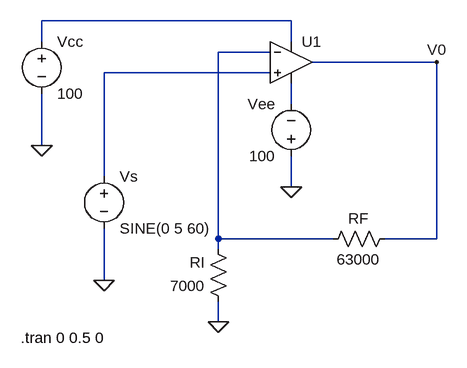
[diagram p0: schematic assig1_q2.asc]
assig1_q2.asc, the LTspice schematic file:
Version 4
SHEET 1 880 680
WIRE 416 112 32 112
WIRE 32 144 32 112
WIRE 416 144 416 112
WIRE 384 160 304 160
WIRE 640 176 448 176
WIRE 384 192 128 192
WIRE 416 240 416 208
WIRE 32 304 32 224
WIRE 128 352 128 192
WIRE 416 368 416 320
WIRE 304 448 304 160
WIRE 480 448 304 448
WIRE 640 448 640 176
WIRE 640 448 560 448
WIRE 304 464 304 448
WIRE 128 512 128 432
WIRE 304 576 304 544
FLAG 304 576 0
FLAG 32 304 0
FLAG 416 368 0
FLAG 128 512 0
FLAG 640 176 V0
SYMBOL res 320 560 R180
WINDOW 0 36 76 Left 2
WINDOW 3 36 40 Left 2
SYMATTR InstName RI
SYMATTR Value 7000
SYMBOL res 464 464 R270
WINDOW 0 32 56 VTop 2
WINDOW 3 0 56 VBottom 2
SYMATTR InstName RF
SYMATTR Value 63000
SYMBOL voltage 32 128 R0
WINDOW 123 0 0 Left 0
WINDOW 39 0 0 Left 0
SYMATTR InstName Vcc
SYMATTR Value 100
SYMBOL voltage 416 336 R180
WINDOW 0 24 96 Left 2
WINDOW 3 24 16 Left 2
WINDOW 123 0 0 Left 0
WINDOW 39 0 0 Left 0
SYMATTR InstName Vee
SYMATTR Value 100
SYMBOL voltage 128 336 R0
WINDOW 123 0 0 Left 0
WINDOW 39 0 0 Left 0
SYMATTR InstName Vs
SYMATTR Value SINE(0 5 60)
SYMBOL OpAmps\\UniversalOpamp2 416 176 R0
SYMATTR InstName U1
SYMATTR Value2 Avol=100 GBW=10Meg Slew=10Meg
TEXT 0 600 Left 2 !.tran 0 0.5 0

The netlist it stands for:
* assig1_q2.asc
RI 0 N002 7000
RF N002 V0 63000
Vcc N001 0 100
Vee 0 N004 100
Vs N003 0 SINE(0 5 60)
XU1 N003 N002 N001 N004 V0 level.2 Avol=100 GBW=10Meg Slew=10Meg ilimit=25m rail=0 Vos=0 phimargin=45 en=0 enk=0 in=0 ink=0 Rin=500Meg  ; pins IN+ IN- V+ V- OUT
.tran 0 0.5 0
.lib UniversalOpamps2.sub
.backanno
.end